# Altium schematic sheet radio-module.SchDoc
size A4
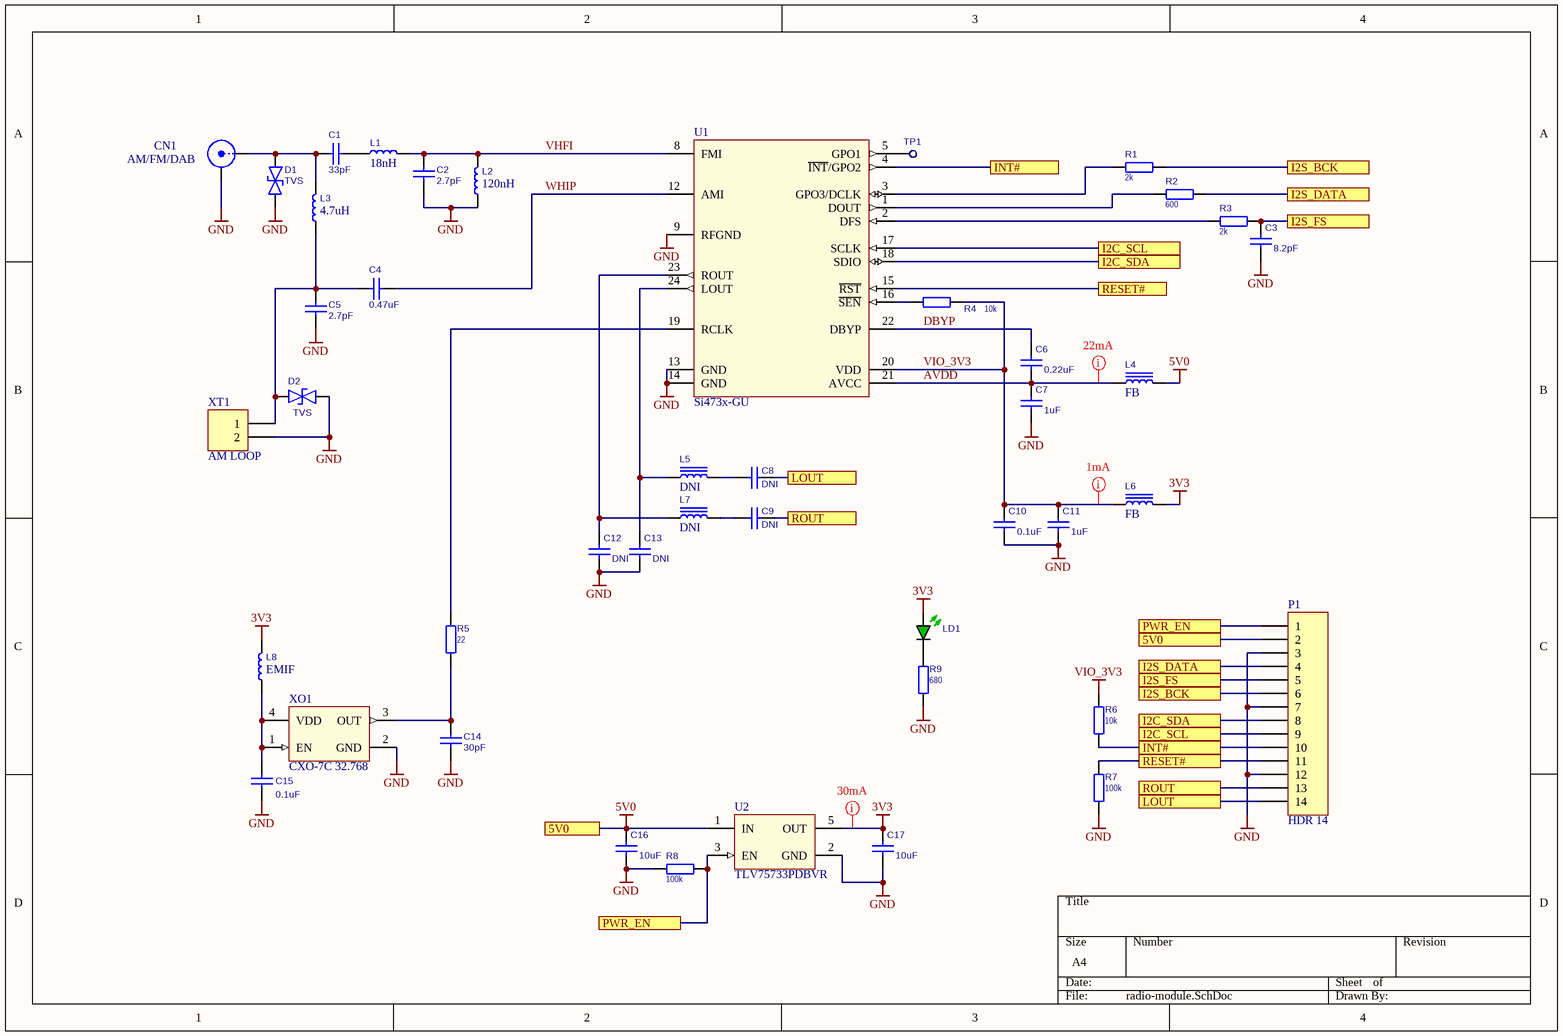
[diagram p0: radio-module.SchDoc]

## Parts
C1  value 33pF  [C0603]  (hidden comment: 06035A330JAT2A)
C2  value 2.7pF  [C0603]  (hidden comment: GCM1885C2A2R7BA16D)
C3  8.2pF  [C0603]
C4  0.47uF  [C0603]
C5  value 2.7pF  [C0603]  (hidden comment: GCM1885C2A2R7BA16D)
C6  0.22uF  [C0603]
C7  1uF  [C0603]
C8  value DNI  [C0603]  (hidden comment: 0.1uF)
C9  value DNI  [C0603]  (hidden comment: 0.1uF)
C10  0.1uF  [C0603]
C11  1uF  [C0603]
C12  value DNI  [C0603]  (hidden comment: 8.2pF)
C13  value DNI  [C0603]  (hidden comment: 8.2pF)
C14  30pF  [C0603]
C15  value 0.1uF  [C0603]  (hidden comment: CC0603KRX7R9BB104)
C16  10uF  [C0603]
C17  10uF  [C0603]
CN1  SMB  [SMB_V-RJ45]  (value not drawn)
D1  value TVS  [SOD-323]  (hidden comment: CDSOD323-T05LC)
D2  value TVS  [SOD-323]  (hidden comment: CDSOD323-T05LC)
L1  value 18nH  [IND0603]  (hidden comment: LQW18AN18NJ0ZD)
L2  value 120nH  [IND0603]  (hidden comment: LQW18ANR12J00D)
L3  value 4.7uH  [IND0603]  (hidden comment: CIL 10J 4R7)
L4  value FB  [IND0603]  (hidden comment: BLM18AG102SN1D)
L5  value DNI  [IND0603]  (hidden comment: BLM18AG102SN1D)
L6  value FB  [IND0603]  (hidden comment: BLM18AG102SN1D)
L7  value DNI  [IND0603]  (hidden comment: BLM18AG102SN1D)
L8  value EMIF  [IND0603]  (hidden comment: BLM18AG102SN1D)
LD1  LED_G  [R0603]  (value not drawn)
P1  HDR 14  [PLS-14]
R1  2k  [R0603]
R2  600  [R0603]
R3  2k  [R0603]
R4  10k  [R0603]
R5  22  [R0603]
R6  10k  [R0603]
R7  100k  [R0603]
R8  100k  [R0603]
R9  680  [R0603]
TP1  TEST-POINT  [PAD]  (value not drawn)
U1  Si473x-GU  [SSOP-24]
U2  TLV75733PDBVR  [SOT-23-5]
XO1  CXO-7C 32.768  [CXO-5032]
XT1  AM LOOP  [PLS-2]

## Ports
5V0, I2C_SCL, I2C_SDA, I2S_BCK, I2S_DATA, I2S_FS, INT#, LOUT, PWR_EN, RESET#, ROUT

## Nets
3V3: C17.1 L6.2 L8.1 LD1.2 U2.5(OUT)
5V0: C16.1 L4.2 P1.2 U2.1(IN) ; port 5V0
GND: C2.1 C3.2 C5.1 C7.2 C10.2 C11.2 C12.2 C13.2 C14.2 C15.1 C16.2 C17.2 CN1.2(Y) D1.1 D2.1 L2.1 P1.3 P1.7 P1.12 R7.1 R8.2 R9.2 U1.9(RFGND) U1.13(GND) U1.14(GND) U2.2(GND) XO1.2(GND) XT1.2
VIO_3V3: C10.1 C11.1 L6.1 R4.1 R6.1 U1.20(VDD)
AVDD: C6.2 C7.1 L4.1 U1.21(AVCC)
DBYP: C6.1 U1.22(DBYP)
I2C_SCL: P1.9 U1.17(SCLK) ; port I2C_SCL
I2C_SDA: P1.8 U1.18(SDIO) ; port I2C_SDA
I2S_BCK: P1.6 R1.1 ; port I2S_BCK
I2S_DATA: P1.4 R2.1 ; port I2S_DATA
I2S_FS: C3.1 P1.5 R3.1 ; port I2S_FS
INT#: P1.10 R6.2 U1.4(~{INT}/GPO2) ; port INT#
LOUT: C8.2 P1.14 ; port LOUT
PWR_EN: P1.1 R8.1 U2.3(EN) ; port PWR_EN
RESET#: P1.11 R7.2 U1.15(~{RST}) ; port RESET#
ROUT: C9.2 P1.13 ; port ROUT
VHFI: C2.2 L1.2 L2.2 U1.8(FMI)
WHIP: C4.1 U1.12(AMI)
NetC1_1: C1.1 L1.1
NetC1_2: C1.2 CN1.1(X) D1.2 L3.2
NetC4_2: C4.2 C5.2 D2.2 L3.1 XT1.1
NetC8_1: C8.1 L5.2
NetC9_1: C9.1 L7.2
NetC12_1: C12.1 L7.1 U1.23(ROUT)
NetC13_1: C13.1 L5.1 U1.24(LOUT)
NetC14_1: C14.1 R5.2 XO1.3(OUT)
NetC15_2: C15.2 L8.2 XO1.1(EN) XO1.4(VDD)
NetLD1_1: LD1.1 R9.1
NetR1_2: R1.2 U1.3(GPO3/DCLK)
NetR2_2: R2.2 U1.1(DOUT)
NetR3_2: R3.2 U1.2(DFS)
NetR4_2: R4.2 U1.16(~{SEN})
NetR5_1: R5.1 U1.19(RCLK)
NetTP1_1: TP1.1 U1.5(GPO1)

## Layout directives
mark named 22mA: AVDD
mark named 1mA: VIO_3V3
mark named 30mA: 3V3

## Notes on the sheet
- (near CN1) AM/FM/DAB

## Library data of the parts
C1-C17 = CAP_NPOL
  C3: Value: 8.2pF
  C4: Value: 0.47uF
  C6: Value: 0.22uF
  C7 C11: Value: 1uF
  C10: Value: 0.1uF
  C14: Value: 30pF
  C16 C17: Value: 10uF
CN1 = SMB: SMB Straight Connector; LatestRevisionDate: 17-Jul-2002; LatestRevisionNote: Re-released for DXP Platform.; Publisher: Altium Limited
D1 D2 = TVS_BIDIR: TVS Diodes
L1-L3 L8 = IND_WO_IRON
L4-L7 = IND_W_IRON
LD1 = LED_GREEN: LED Green; Value: *
P1 = HDR 14: Header, 14-Pin; LatestRevisionDate: 17-Jul-2002; LatestRevisionNote: Re-released for DXP Platform.; Publisher: Altium Limited
R1-R9 = RESISTOR: RES
  R1 R3: Value: 2k
  R2: Value: 600
  R4 R6: Value: 10k
  R5: Value: 22
  R7 R8: Value: 100k
  R9: Value: 680
TP1 = TEST-POINT: PCB terminal block; Value: *
U1 = Si473x-GU: BROADCAST AM/FM/SW/LW RADIO RECEIVER; Value: Si473x-GU
U2 = TLV733P: Capacitor-Free, 1A, Low-Dropout Regulator with Foldback Current Limit for Portable Devices; value: TLV75733PDBVR
XO1 = CXO-7C: value: CXO-7C
XT1 = HDR 2: Header, 2-Pin; LatestRevisionDate: 17-Jul-2002; LatestRevisionNote: Re-released for DXP Platform.; Publisher: Altium Limited